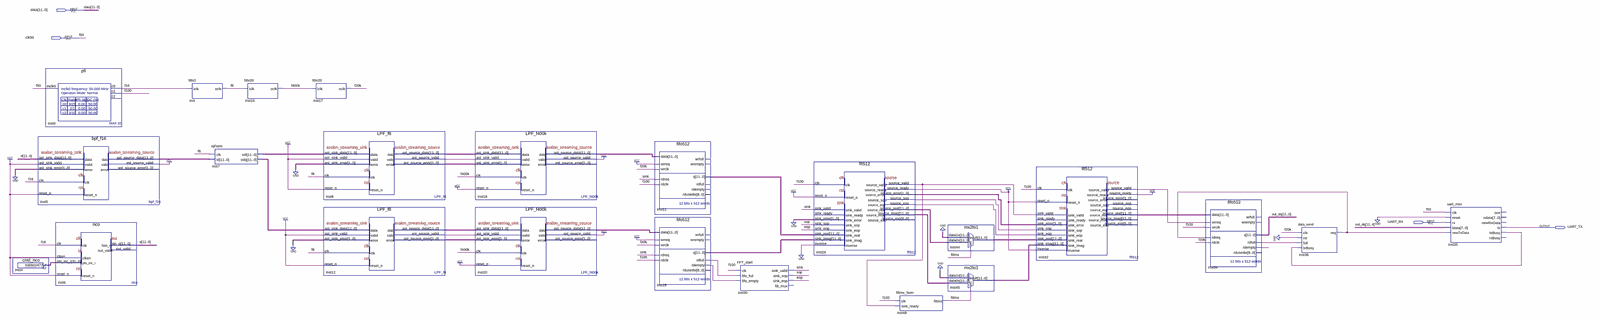
[diagram p0: schematic sheet, whole]
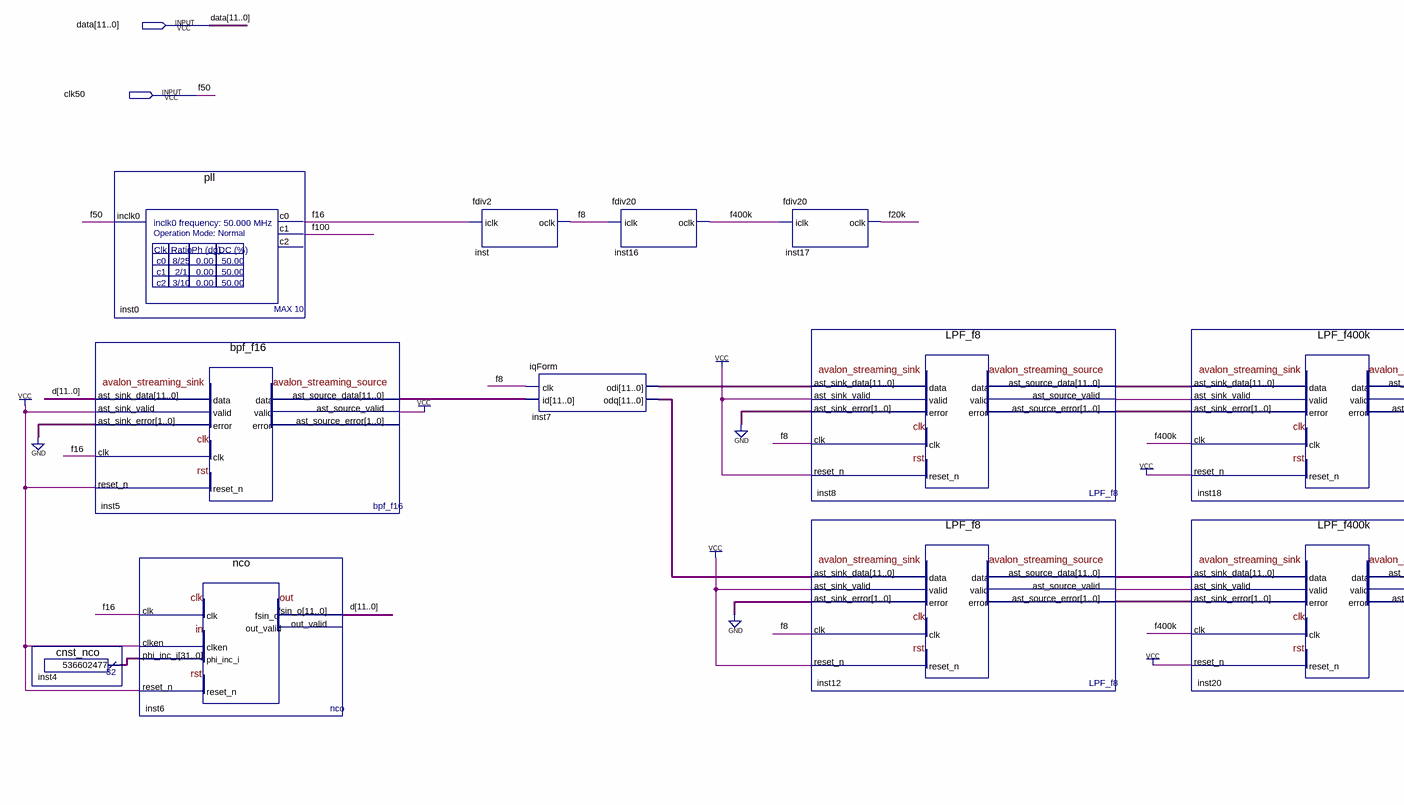
[diagram p1: schematic sheet, left part]
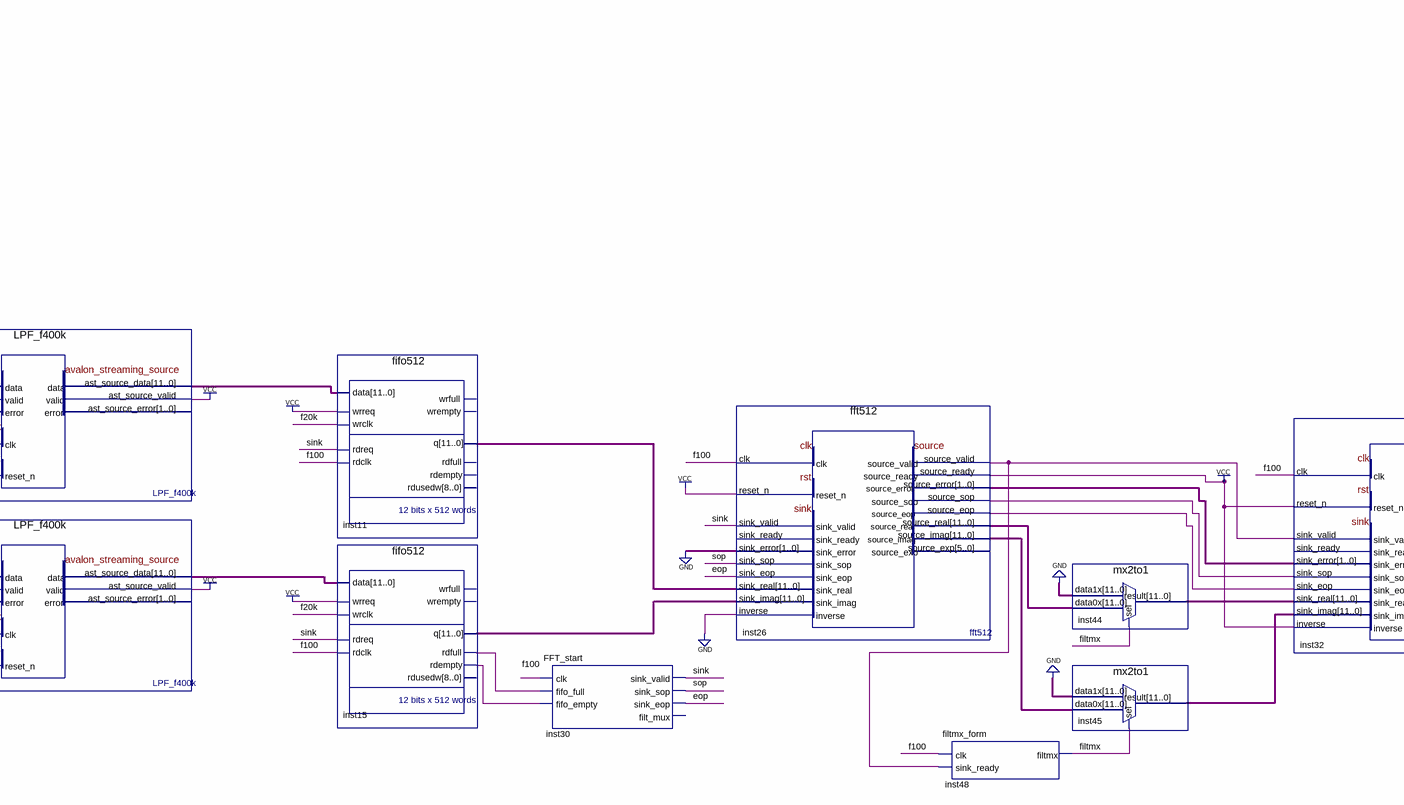
[diagram p2: schematic sheet, centre part]
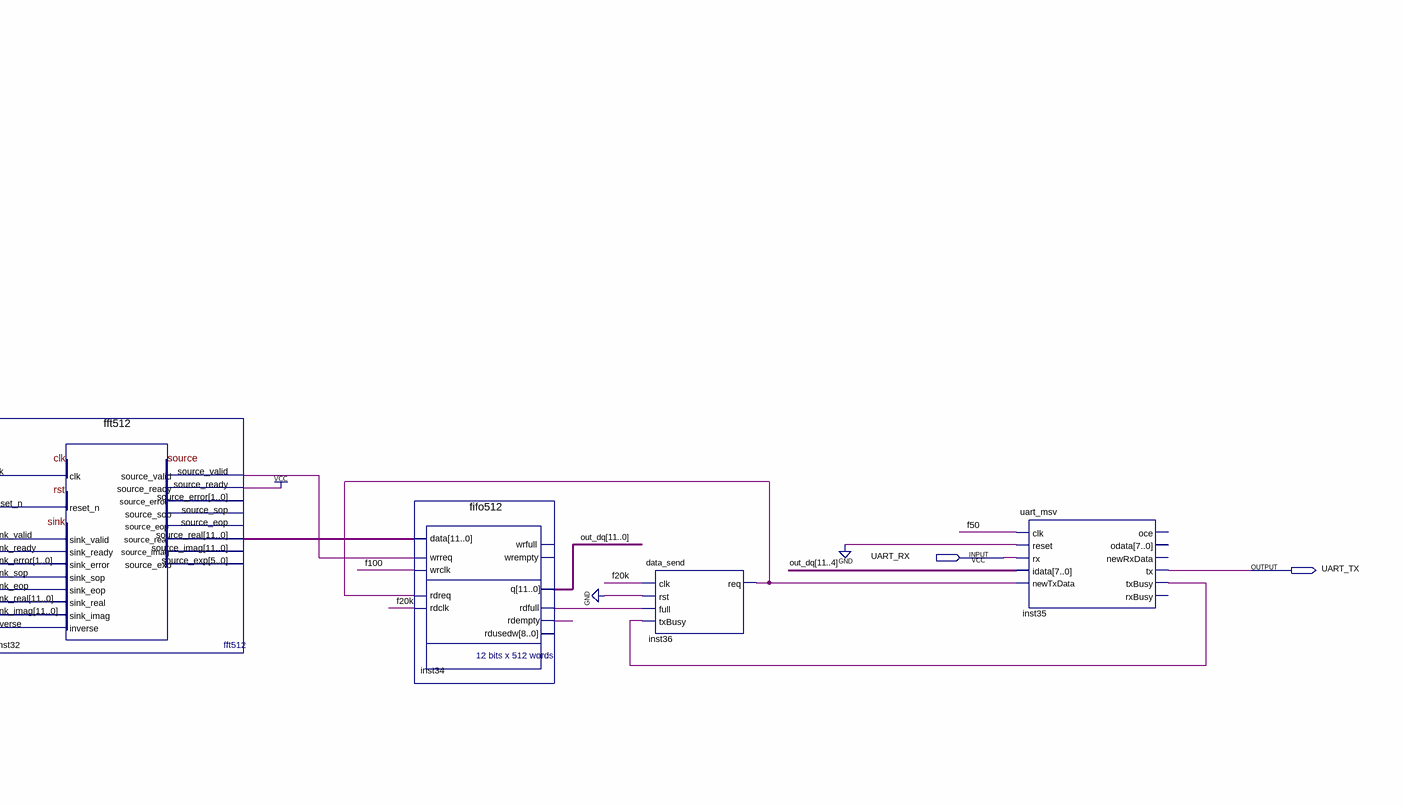
[diagram p3: schematic sheet, right part]
// Quartus schematic us_dsp.bdf as structural Verilog: 23 symbols, 4 pins
module us_dsp (
  input  [11:0] data,
  input  clk50,
  input  UART_RX,
  output UART_TX
);

  wire eop, f8, f16, f20k, f100, f400k, filtmx, inst5_ast_source_valid, inst8_ast_source_valid,
       inst12_ast_source_valid, inst15_rdempty, inst15_rdfull, inst18_ast_source_valid,
       inst20_ast_source_valid, inst26_source_eop, inst26_source_sop, inst26_source_valid,
       inst32_source_valid, inst34_rdempty, inst34_rdfull, inst35_txbusy, inst36_req, sink, sop;
  wire [1:0] inst8_ast_source_error, inst12_ast_source_error, inst26_source_error;
  wire [11:0] d, inst5_ast_source_data, inst7_odi, inst7_odq, inst8_ast_source_data, inst11_q,
       inst12_ast_source_data, inst15_q, inst18_ast_source_data, inst20_ast_source_data, inst26_source_imag,
       inst26_source_real, inst32_source_real, inst44_result, inst45_result, out_dq;
  wire [31:0] inst4_result;

  cnst_nco inst4 (.result(inst4_result));
  bpf_f16 inst5 (
    .ast_sink_data(d), .ast_sink_valid(1'b1), .ast_sink_error(2'b00), .clk(f16), .reset_n(1'b1),
    .ast_source_data(inst5_ast_source_data), .ast_source_valid(inst5_ast_source_valid));  // open: ast_source_error
  pll inst0 (.inclk0(clk50), .c0(f16), .c1(f100));  // open: c2
  nco inst6 (.clk(f16), .clken(1'b1), .phi_inc_i(inst4_result), .reset_n(1'b1), .fsin_o(d));  // open: out_valid
  fdiv2 inst (.iclk(f16), .oclk(f8));
  iqForm inst7 (.clk(f8), .id(inst5_ast_source_data), .odi(inst7_odi), .odq(inst7_odq));
  fdiv20 inst16 (.iclk(f8), .oclk(f400k));
  fdiv20 inst17 (.iclk(f400k), .oclk(f20k));
  LPF_f8 inst8 (
    .ast_sink_data(inst7_odi), .ast_sink_valid(1'b1), .ast_sink_error(2'b00), .clk(f8), .reset_n(1'b1),
    .ast_source_data(inst8_ast_source_data), .ast_source_valid(inst8_ast_source_valid),
    .ast_source_error(inst8_ast_source_error));
  LPF_f8 inst12 (
    .ast_sink_data(inst7_odq), .ast_sink_valid(1'b1), .ast_sink_error(2'b00), .clk(f8), .reset_n(1'b1),
    .ast_source_data(inst12_ast_source_data), .ast_source_valid(inst12_ast_source_valid),
    .ast_source_error(inst12_ast_source_error));
  LPF_f400k inst18 (
    .ast_sink_data(inst8_ast_source_data), .ast_sink_valid(inst8_ast_source_valid),
    .ast_sink_error(inst8_ast_source_error), .clk(f400k), .reset_n(1'b1),
    .ast_source_data(inst18_ast_source_data), .ast_source_valid(inst18_ast_source_valid));  // open: ast_source_error
  LPF_f400k inst20 (
    .ast_sink_data(inst12_ast_source_data), .ast_sink_valid(inst12_ast_source_valid),
    .ast_sink_error(inst12_ast_source_error), .clk(f400k), .reset_n(1'b1),
    .ast_source_data(inst20_ast_source_data), .ast_source_valid(inst20_ast_source_valid));  // open: ast_source_error
  fifo512 inst11 (
    .data(inst18_ast_source_data), .wrreq(1'b1), .wrclk(f20k), .rdreq(sink), .rdclk(f100), .q(inst11_q));  // open: wrfull, wrempty, rdfull, rdempty, rdusedw
  fifo512 inst15 (
    .data(inst20_ast_source_data), .wrreq(1'b1), .wrclk(f20k), .rdreq(sink), .rdclk(f100), .q(inst15_q),
    .rdfull(inst15_rdfull), .rdempty(inst15_rdempty));  // open: wrfull, wrempty, rdusedw
  FFT_start inst30 (
    .clk(f100), .fifo_full(inst15_rdfull), .fifo_empty(inst15_rdempty), .sink_valid(sink), .sink_sop(sop),
    .sink_eop(eop));  // open: filt_mux
  fft512 inst26 (
    .clk(f100), .reset_n(1'b1), .sink_valid(sink), .sink_error(2'b00), .sink_sop(sop), .sink_eop(eop),
    .sink_real(inst11_q), .sink_imag(inst15_q), .inverse(1'b0), .source_ready(1'b1),
    .source_valid(inst26_source_valid), .source_error(inst26_source_error), .source_sop(inst26_source_sop),
    .source_eop(inst26_source_eop), .source_real(inst26_source_real), .source_imag(inst26_source_imag));  // open: sink_ready, source_exp
  filtmx_form inst48 (.clk(f100), .sink_ready(inst26_source_valid), .filtmx(filtmx));
  mx2to1 inst44 (.data1x({12{1'b0}}), .data0x(inst26_source_real), .sel(filtmx), .result(inst44_result));
  mx2to1 inst45 (.data1x({12{1'b0}}), .data0x(inst26_source_imag), .sel(filtmx), .result(inst45_result));
  fft512 inst32 (
    .clk(f100), .reset_n(1'b1), .sink_valid(inst26_source_valid), .sink_error(inst26_source_error),
    .sink_sop(inst26_source_sop), .sink_eop(inst26_source_eop), .sink_real(inst44_result),
    .sink_imag(inst45_result), .inverse(1'b1), .source_ready(1'b1), .source_valid(inst32_source_valid),
    .source_real(inst32_source_real));  // open: sink_ready, source_error, source_sop, source_eop, source_imag, source_exp
  fifo512 inst34 (
    .data(inst32_source_real), .wrreq(inst32_source_valid), .wrclk(f100), .rdreq(inst36_req), .rdclk(f20k),
    .q(out_dq), .rdfull(inst34_rdfull), .rdempty(inst34_rdempty));  // open: wrfull, wrempty, rdusedw
  data_send inst36 (.clk(f20k), .rst(1'b0), .full(inst34_rdfull), .txBusy(inst35_txbusy), .req(inst36_req));
  uart_msv inst35 (
    .clk(clk50), .reset(1'b0), .rx(UART_RX), .idata(out_dq[11:4]), .newTxData(inst36_req), .tx(UART_TX),
    .txBusy(inst35_txbusy));  // open: oce, odata, newRxData, rxBusy
  // also tied to VCC on the sheet: {inst5_ast_source_valid, inst18_ast_source_valid, inst20_ast_source_valid}

  // Other names for the same wires on the sheet: f50 = clk50
endmodule
